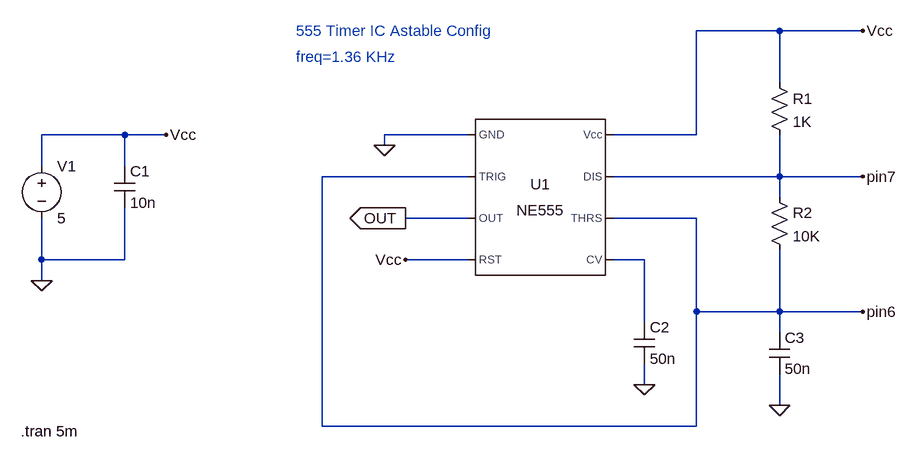
[diagram p0: schematic 555 Timer Astable Multivibrator.asc]
555 Timer Astable Multivibrator.asc, the LTspice schematic file:
Version 4.1
SHEET 1 1348 680
WIRE 1152 -80 1024 -80
WIRE 1280 -80 1152 -80
WIRE 1152 0 1152 -80
WIRE 144 80 16 80
WIRE 208 80 144 80
WIRE 672 80 544 80
WIRE 1024 80 1024 -80
WIRE 1024 80 896 80
WIRE 544 96 544 80
WIRE 16 128 16 80
WIRE 144 128 144 80
WIRE 672 144 448 144
WIRE 1152 144 1152 80
WIRE 1152 144 896 144
WIRE 1280 144 1152 144
WIRE 1152 176 1152 144
WIRE 672 208 576 208
WIRE 1024 208 896 208
WIRE 16 272 16 208
WIRE 144 272 144 192
WIRE 144 272 16 272
WIRE 672 272 576 272
WIRE 944 272 896 272
WIRE 16 304 16 272
WIRE 1024 352 1024 208
WIRE 1152 352 1152 256
WIRE 1152 352 1024 352
WIRE 1280 352 1152 352
WIRE 944 368 944 272
WIRE 1152 384 1152 352
WIRE 944 464 944 432
WIRE 1152 496 1152 448
WIRE 448 528 448 144
WIRE 1024 528 1024 352
WIRE 1024 528 448 528
FLAG 16 304 0
FLAG 544 96 0
FLAG 944 464 0
FLAG 208 80 Vcc
FLAG 576 272 Vcc
FLAG 1280 -80 Vcc
FLAG 576 208 OUT
IOPIN 576 208 Out
FLAG 1280 144 pin7
FLAG 1280 352 pin6
FLAG 1152 496 0
SYMBOL voltage 16 112 R0
WINDOW 123 0 0 Left 0
WINDOW 39 0 0 Left 0
SYMATTR InstName V1
SYMATTR Value 5
SYMBOL cap 128 128 R0
SYMATTR InstName C1
SYMATTR Value 10n
SYMBOL Misc\\NE555 784 176 R0
SYMATTR InstName U1
SYMBOL res 1136 -16 R0
SYMATTR InstName R1
SYMATTR Value 1K
SYMBOL res 1136 160 R0
SYMATTR InstName R2
SYMATTR Value 10K
SYMBOL cap 928 368 R0
SYMATTR InstName C2
SYMATTR Value 50n
SYMBOL cap 1136 384 R0
SYMATTR InstName C3
SYMATTR Value 50n
TEXT 408 -80 Left 2 ;555 Timer IC Astable Config
TEXT -16 536 Left 2 !.tran 5m
TEXT 408 -40 Left 2 ;freq=1.36 KHz

The netlist it stands for:
* 555 Timer Astable Multivibrator.asc
V1 Vcc 0 5
C1 Vcc 0 10n
X§U1 0 pin6 OUT Vcc N001 pin6 pin7 Vcc NE555  ; pins GND TRIG OUT RST CV THRS DIS Vcc
R1 Vcc pin7 1K
R2 pin7 pin6 10K
C2 N001 0 50n
C3 pin6 0 50n
* 555 Timer IC Astable Config
.tran 5m
* freq=1.36 KHz
.lib NE555.sub
.backanno
.end